# Altium schematic sheet PowerDistributionBoard.SchDoc
size A
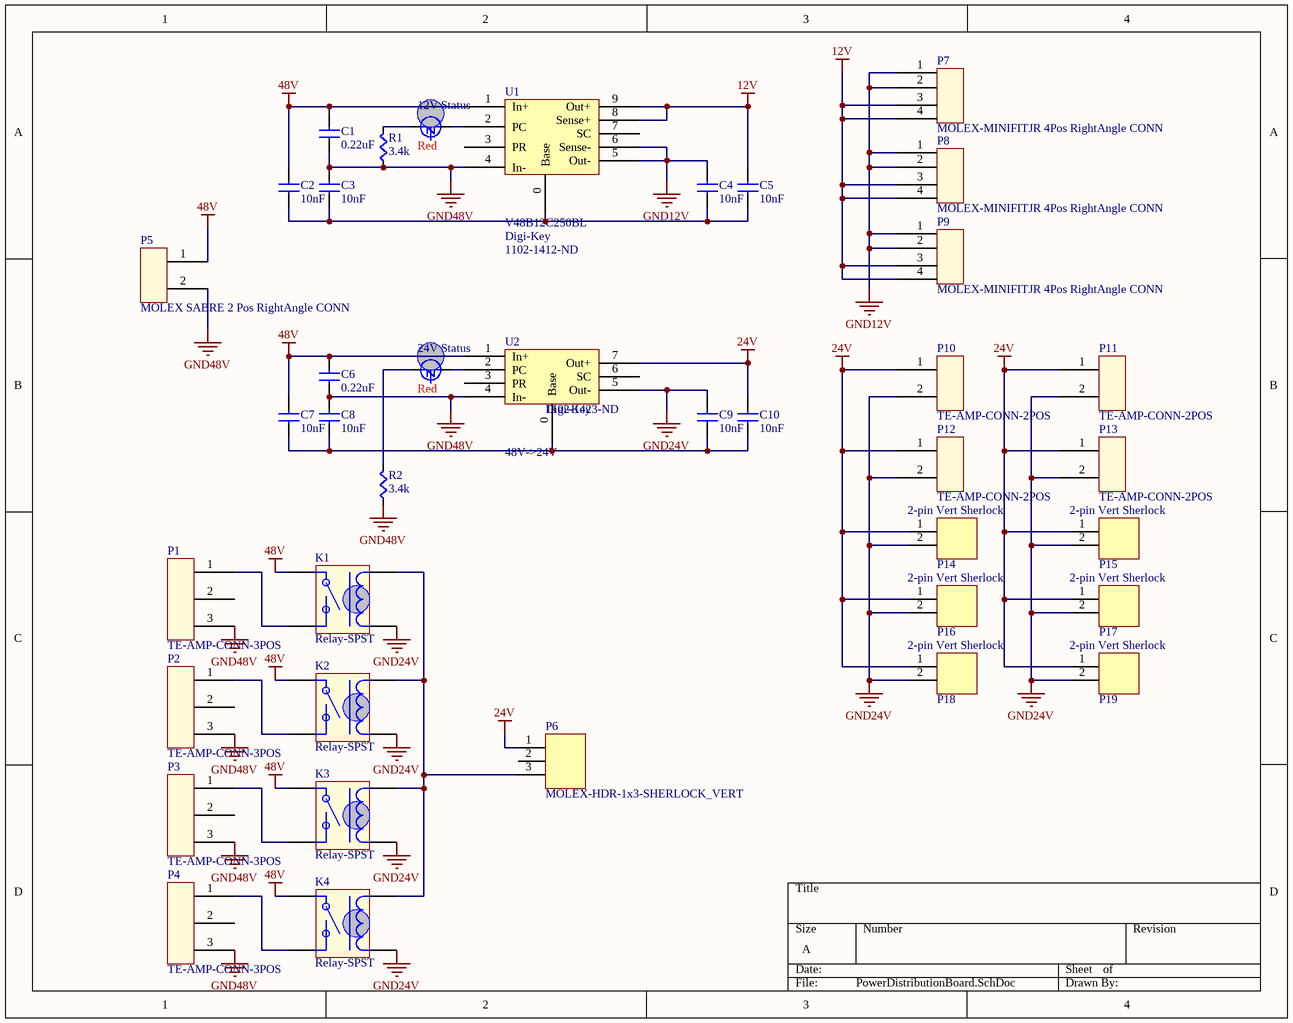
[diagram p0: PowerDistributionBoard.SchDoc]

## Parts
12V_Status  Color: Red  [LED0603]  (hidden comment: LED)
24V_Status  Color: Red  [LED0603]  (hidden comment: LED)
C1  value 0.22uF  [CAP2225]  (hidden comment: Cap)
C2  value 10nF  [CAP2225]  (hidden comment: Cap)
C3  value 10nF  [CAP2225]  (hidden comment: Cap)
C4  value 10nF  [CAP2225]  (hidden comment: Cap)
C5  value 10nF  [CAP2225]  (hidden comment: Cap)
C6  value 0.22uF  [CAP2225]  (hidden comment: Cap)
C7  value 10nF  [CAP2225]  (hidden comment: Cap)
C8  value 10nF  [CAP2225]  (hidden comment: Cap)
C9  value 10nF  [CAP2225]  (hidden comment: Cap)
C10  value 10nF  [CAP2225]  (hidden comment: Cap)
K1  Relay-SPST  [G5LE-1A4 DC24]
K2  Relay-SPST  [G5LE-1A4 DC24]
K3  Relay-SPST  [G5LE-1A4 DC24]
K4  Relay-SPST  [G5LE-1A4 DC24]
P1  TE-AMP-CONN-3POS  [TE AMP CONN 2POS - duplicate]
P2  TE-AMP-CONN-3POS  [TE AMP CONN 2POS - duplicate]
P3  TE-AMP-CONN-3POS  [TE AMP CONN 2POS - duplicate]
P4  TE-AMP-CONN-3POS  [TE AMP CONN 2POS - duplicate]
P5  MOLEX SABRE 2 Pos RightAngle CONN  [MOLEX-SABRE-2PIN-RA]
P6  MOLEX-HDR-1x3-SHERLOCK_VERT  [MOLEX-HDR-1X3-SHERLOCK-VERT]
P7  MOLEX-MINIFITJR 4Pos RightAngle CONN  [MOLEX-MINIFITJR-4PINRA]
P8  MOLEX-MINIFITJR 4Pos RightAngle CONN  [MOLEX-MINIFITJR-4PINRA]
P9  MOLEX-MINIFITJR 4Pos RightAngle CONN  [MOLEX-MINIFITJR-4PINRA]
P10  TE-AMP-CONN-2POS  [TE AMP CONN 2POS]
P11  TE-AMP-CONN-2POS  [TE AMP CONN 2POS]
P12  TE-AMP-CONN-2POS  [TE AMP CONN 2POS]
P13  TE-AMP-CONN-2POS  [TE AMP CONN 2POS]
P14  2-pin Vert Sherlock  [MOLEX-HDR-1X2-SHERLOCK-VERT]
P15  2-pin Vert Sherlock  [MOLEX-HDR-1X2-SHERLOCK-VERT]
P16  2-pin Vert Sherlock  [MOLEX-HDR-1X2-SHERLOCK-VERT]
P17  2-pin Vert Sherlock  [MOLEX-HDR-1X2-SHERLOCK-VERT]
P18  2-pin Vert Sherlock  [MOLEX-HDR-1X2-SHERLOCK-VERT]
P19  2-pin Vert Sherlock  [MOLEX-HDR-1X2-SHERLOCK-VERT]
R1  value 3.4k  [RES0603]  (hidden comment: Res)
R2  value 3.4k  [RES0603]  (hidden comment: Res)
U1  V48B12C250BL  Supplier1: Digi-Key  Supplier Part Number 1: 1102-1412-ND  [FASTRAK_MINI_ONBOARD_MOUNT]
U2  48V->24V  Supplier 1: Digi-Key  Supplier Part Number 1: 1102-1423-ND  [FASTRAK_MICRO_ONBOARD_MOUNT]

## Nets
12V: C5.1(A) P7.3 P7.4 P8.3 P8.4 P9.3 P9.4 U1.8(Sense+) U1.9(Out+)
24V: C10.1(A) P6.1 P10.1 P11.1 P12.1 P13.1 P14.1 P15.1 P16.1 P17.1 P18.1 P19.1 U2.7(Out+)
48V: C1.1(A) C2.1(A) C6.1(A) C7.1(A) K1.1 K2.1 K3.1 K4.1 P5.1 U1.1(In+) U2.1(In+)
GND12V: C4.1(A) P7.1 P7.2 P8.1 P8.2 P9.1 P9.2 U1.5(Out-) U1.6(Sense-)
GND24V: C9.1(A) K1.5 K2.5 K3.5 K4.5 P10.2 P11.2 P12.2 P13.2 P14.2 P15.2 P16.2 P17.2 P18.2 P19.2 U2.5(Out-)
GND48V: C1.2(B) C3.1(A) C6.2(B) C8.1(A) P1.3 P2.3 P3.3 P4.3 P5.2 R1.2(B) R2.2(B) U1.4(In-) U2.4(In-)
Net12V_Status_A: 12V_Status.A U1.2(PC)
Net12V_Status_C: 12V_Status.C R1.1(A)
Net24V_Status_A: 24V_Status.A U2.2(PC)
Net24V_Status_C: 24V_Status.C R2.1(A)
NetC2_2: C2.2(B) C3.2(B) C4.2(B) C5.2(B) U1.0(Base)
NetC7_2: C7.2(B) C8.2(B) C9.2(B) C10.2(B) U2.0(Base)
NetK1_2: K1.2 K2.2 K3.2 K4.2 P6.3
NetK1_3: K1.3 P1.1
NetK2_3: K2.3 P2.1
NetK3_3: K3.3 P3.1
NetK4_3: K4.3 P4.1

Not connected (* = marked no-connect by the designer): P1 2; P2 2; P3 2; P4 2; P6 2; U1 3(PR) 7(SC); U2 3(PR) 6(SC)

## Library data of the parts
K1-K4 = Relay-SPST: General Purpose Relay SPST-NO (1 Form A) 24VDC Coil Through Hole; Supplier Part Number 1: Z2254-ND; Supplier 1: Digi-Key
P1-P4 = TE-AMP-CONN-3POS: 3 Positions Header Connector 0.156" (3.96mm) Through Hole Tin; Supplier 1: Digi-Key; Supplier Part Number 1: A99846-ND; Mating Conn. Digi-Key P/N: A103941-ND
P6 = MOLEX-HDR-1x3-SHERLOCK_VERT: Header, Molex, 2mm Pitch Sherlock Header, Single Row, Vertical, 3 Circuits, Length 3.3mm, 0353620376; Manufacturer Part Number: *; Order Part Number: *
P10-P13 = TE-AMP-CONN-2POS: 2 Positions Header Connector 0.156" (3.96mm) Through Hole Tin; Supplier 1: Digi-Key; Supplier Part Number 1: A99845-ND; Mating Conn. Digi-Key P/N: A103948-ND
P14-P19 = MOLEX-HDR-1x2-SHERLOCK_VERT: Header, Molex, 2mm Pitch Sherlock Header, Single Row, Vertical, 2 Circuits, Length 3.3mm, 0353620250; Supplier 1: Digi-Key; Supplier Part Number 1: WM18920-ND
U1 = V48B12C250BL: CONVERTER MOD DC/DC 12V 250W
U2 = V48C24C150BL: CONVERTER MOD DC/DC 24V 150W
12V_Status 24V_Status = LED: Supplier 1: Digi-Key; Supplier Part Number 1: 754-1122-1-ND
C1-C10 = Cap: Supplier 1: Digi-Key
  C1 C6: Supplier Part Number 1: 399-3460-1-ND
  C2-C5 C7-C10: Supplier Part Number 1: 399-7323-1-ND
P5 = MOLEX SABRE 2 Pos RightAngle CONN: Supplier 1: Digi-Key; Supplier Part Number 1: WM18483-ND
P7-P9 = MOLEX-MINIFITJR 4Pos RightAngle CONN: Supplier 1: Digi-Key; Supplier Part Number 1: WM1352-ND
R1 R2 = Res: Supplier 1: Digi-Key; Supplier Part Number 1: RMCF0603FT3K40CT-ND